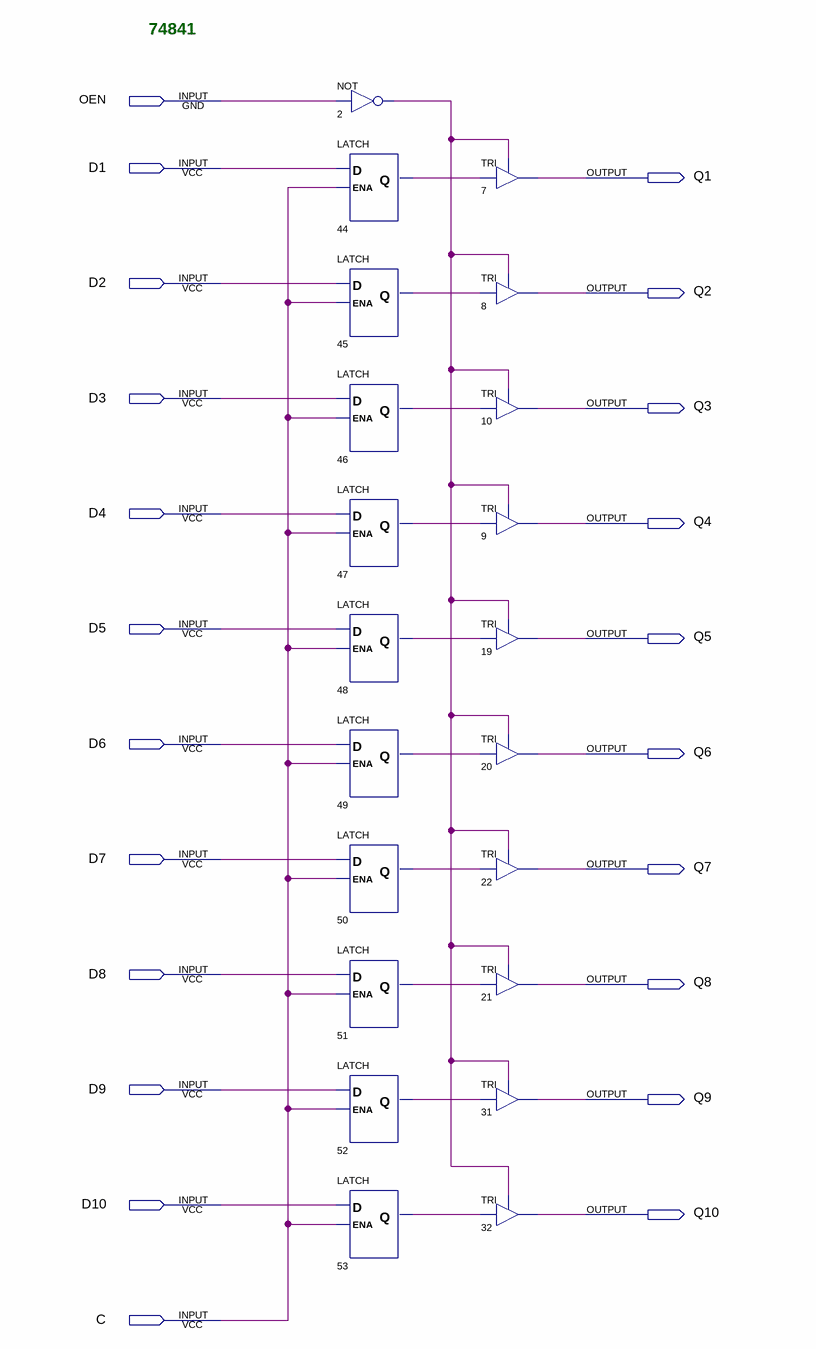
[diagram p0: schematic sheet]
// Quartus schematic 74841.bdf as structural Verilog: 21 symbols, 22 pins
module \74841  (
  input  OEN,
  input  D1,
  input  D2,
  input  D3,
  input  D4,
  input  D5,
  input  D6,
  input  D7,
  input  D8,
  input  D9,
  input  D10,
  input  C,
  output Q1,
  output Q2,
  output Q3,
  output Q4,
  output Q5,
  output Q6,
  output Q7,
  output Q8,
  output Q9,
  output Q10
);

  wire n2_out, n44_q, n45_q, n46_q, n47_q, n48_q, n49_q, n50_q, n51_q, n52_q, n53_q;

  not u_2 (n2_out, OEN);
  LATCH u_44 (.D(D1), .ENA(C), .Q(n44_q));
  LATCH u_45 (.D(D2), .ENA(C), .Q(n45_q));
  LATCH u_46 (.D(D3), .ENA(C), .Q(n46_q));
  LATCH u_47 (.D(D4), .ENA(C), .Q(n47_q));
  LATCH u_48 (.D(D5), .ENA(C), .Q(n48_q));
  LATCH u_49 (.D(D6), .ENA(C), .Q(n49_q));
  LATCH u_50 (.D(D7), .ENA(C), .Q(n50_q));
  LATCH u_51 (.D(D8), .ENA(C), .Q(n51_q));
  LATCH u_52 (.D(D9), .ENA(C), .Q(n52_q));
  LATCH u_53 (.D(D10), .ENA(C), .Q(n53_q));
  TRI u_7 (.IN(n44_q), .OE(n2_out), .OUT(Q1));
  TRI u_8 (.IN(n45_q), .OE(n2_out), .OUT(Q2));
  TRI u_10 (.IN(n46_q), .OE(n2_out), .OUT(Q3));
  TRI u_9 (.IN(n47_q), .OE(n2_out), .OUT(Q4));
  TRI u_19 (.IN(n48_q), .OE(n2_out), .OUT(Q5));
  TRI u_20 (.IN(n49_q), .OE(n2_out), .OUT(Q6));
  TRI u_22 (.IN(n50_q), .OE(n2_out), .OUT(Q7));
  TRI u_21 (.IN(n51_q), .OE(n2_out), .OUT(Q8));
  TRI u_31 (.IN(n52_q), .OE(n2_out), .OUT(Q9));
  TRI u_32 (.IN(n53_q), .OE(n2_out), .OUT(Q10));

  // Notes on the sheet:
  //   74841
endmodule
